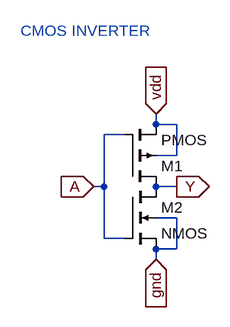
[diagram p0: schematic inverter.asc]
inverter.asc, the LTspice schematic file:
Version 4
SHEET 1 880 680
WIRE 256 64 256 48
WIRE 288 64 256 64
WIRE 208 80 176 80
WIRE 288 112 288 64
WIRE 288 112 256 112
WIRE 176 160 176 80
WIRE 176 160 160 160
WIRE 288 160 256 160
WIRE 288 208 256 208
WIRE 176 240 176 160
WIRE 208 240 176 240
WIRE 288 256 288 208
WIRE 288 256 256 256
WIRE 256 272 256 256
FLAG 256 48 vdd
IOPIN 256 48 In
FLAG 160 160 A
IOPIN 160 160 In
FLAG 288 160 Y
IOPIN 288 160 Out
FLAG 256 272 gnd
IOPIN 256 272 In
SYMBOL pmos4 208 160 M180
SYMATTR InstName M1
SYMBOL nmos4 208 160 R0
SYMATTR InstName M2
TEXT 48 -80 Left 2 ;CMOS INVERTER

The netlist it stands for:
* inverter.asc
M1 Y A vdd vdd PMOS
M2 Y A gnd gnd NMOS
.model NMOS NMOS
.model PMOS PMOS
.lib standard.mos
* CMOS INVERTER
.backanno
.end